# Altium schematic sheet Microcontroller (F446).SchDoc
size A3; SheetNumber: 4; SheetTotal: 6
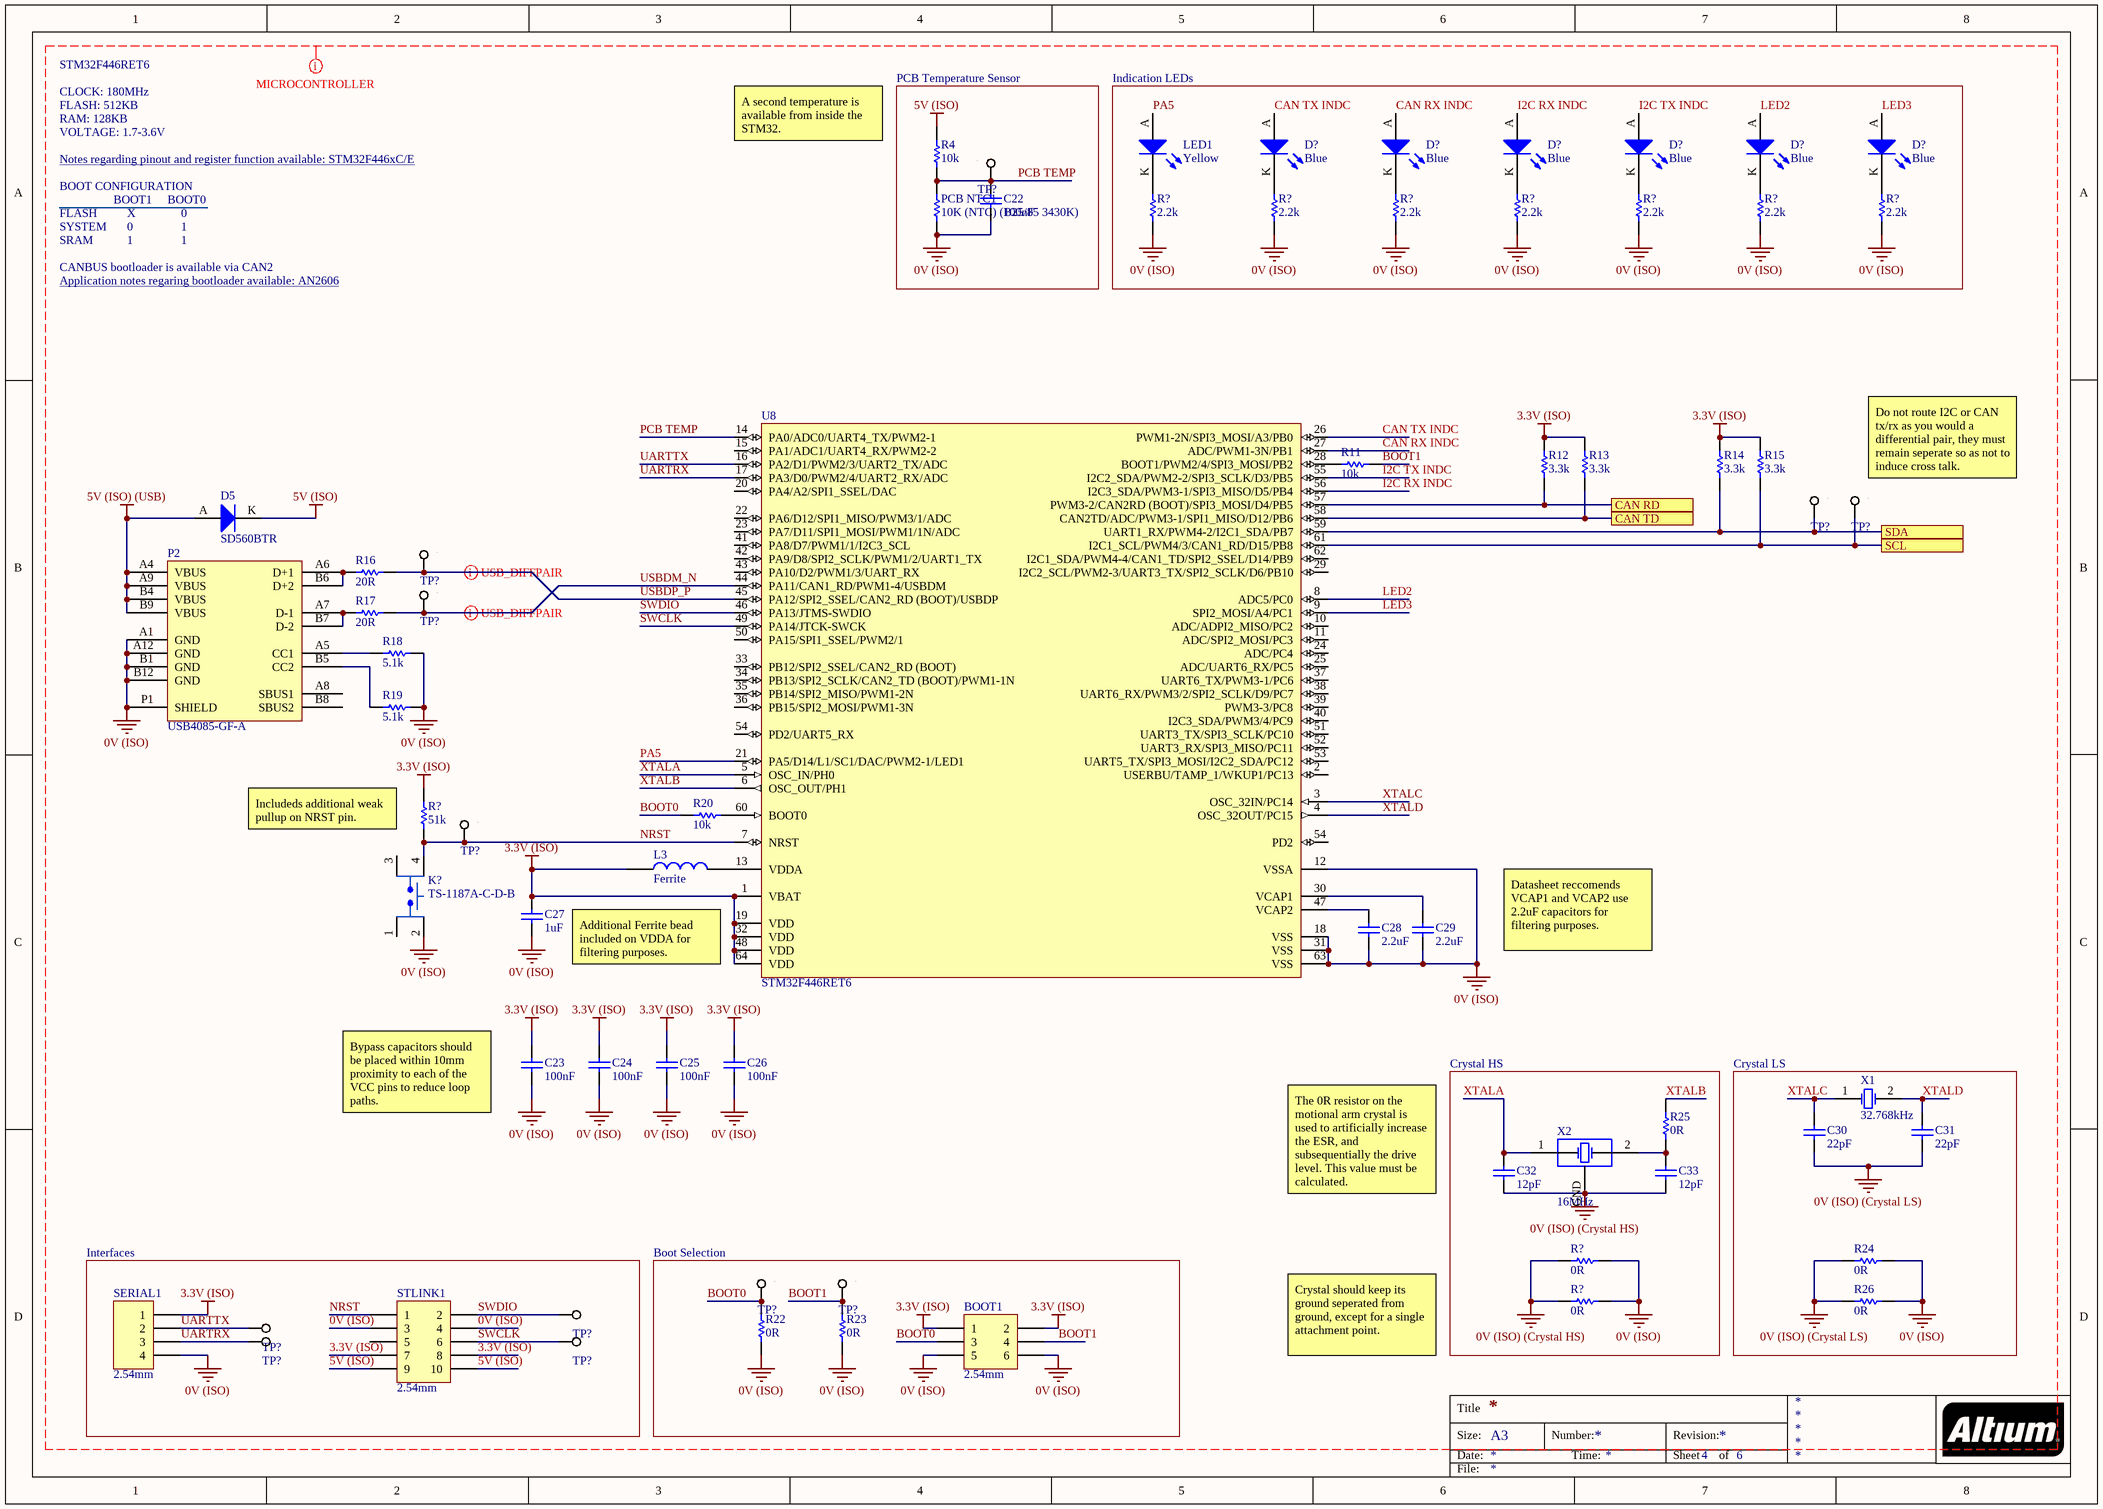
[diagram p0: Microcontroller (F446).SchDoc]

## Parts
(Parts that share a designator on the sheet are numbered #1, #2 ... from top to bottom, then left to right.)
BOOT1  2.54mm  [TH 2.54mm Header 2x3]
C22  100nF  [0805]
C23  100nF  [0805]
C24  100nF  [0805]
C25  100nF  [0805]
C26  100nF  [0805]
C27  1uF  [0805]
C28  2.2uF  [0805]
C29  2.2uF  [0805]
C30  22pF  [0805]
C31  22pF  [0805]
C32  12pF  [0805]
C33  12pF  [0805]
D5  SD560BTR  [SMB Diode]
D?#1  Blue  [0805 LED]
D?#2  Blue  [0805 LED]
D?#3  Blue  [0805 LED]
D?#4  Blue  [0805 LED]
D?#5  Blue  [0805 LED]
D?#6  Blue  [0805 LED]
K?  TS-1187A-C-D-B  [XKB SW-4.5]
L3  Ferrite  [0805]
LED1  Yellow  [0805 LED]
P2  USB4085-GF-A  [USB4085-GF-A]
PCB_NTC1  10K (NTC) (B25/85 3430K)  [0805]
R4  10k  [0805]
R11  10k  [0805]
R12  3.3k  [0805]
R13  3.3k  [0805]
R14  3.3k  [0805]
R15  3.3k  [0805]
R16  20R  [0805]
R17  20R  [0805]
R18  5.1k  [0805]
R19  5.1k  [0805]
R20  10k  [0805]
R22  0R  [0805]
R23  0R  [0805]
R24  0R  [0805]
R25  0R  [0805]
R26  0R  [0805]
R?#1  2.2k  [0805]
R?#2  2.2k  [0805]
R?#3  2.2k  [0805]
R?#4  2.2k  [0805]
R?#5  2.2k  [0805]
R?#6  2.2k  [0805]
R?#7  2.2k  [0805]
R?#8  51k  [0805]
R?#9  0R  [0805]
R?#10  0R  [0805]
SERIAL1  2.54mm  [TH 2.54mm Header 1x4]
STLINK1  2.54mm  [TH 2.54mm Header 2x5]
TP?#1  0mm  [SMD Test Point 1mm]  (value not drawn)
TP?#2  0mm  [SMD Test Point 1mm]  (value not drawn)
TP?#3  0mm  [SMD Test Point 1mm]  (value not drawn)
TP?#4  0mm  [SMD Test Point 1mm]  (value not drawn)
TP?#5  0mm  [SMD Test Point 1mm]  (value not drawn)
TP?#6  0mm  [SMD Test Point 1mm]  (value not drawn)
TP?#7  0mm  [SMD Test Point 1mm]  (value not drawn)
TP?#8  0mm  [SMD Test Point 1mm]  (value not drawn)
TP?#9  0mm  [SMD Test Point 1mm]  (value not drawn)
TP?#10  0mm  [SMD Test Point 1mm]  (value not drawn)
TP?#11  0mm  [SMD Test Point 1mm]  (value not drawn)
TP?#12  0mm  [SMD Test Point 1mm]  (value not drawn)
U8  STM32F446RET6  [STM 64-LQFP]
X1  32.768kHz  [EPSON 2-SMD]
X2  16MHz  [Abracon 4-SMD 3.2x2.5]

## Blocks framed on the sheet
PCB Temperature Sensor: C22 PCB_NTC1 R4 TP?#1
Indication LEDs: D?#1-D?#6 LED1 R?#1-R?#7
Crystal HS: C32 C33 R25 R?#9 R?#10 X2
Crystal LS: C30 C31 R24 R26 X1
Interfaces: SERIAL1 STLINK1 TP?#9-TP?#12
Boot Selection: BOOT1 R22 R23 TP?#7 TP?#8

## Ports
CAN RD, CAN TD, SCL, SDA

## Nets
0V (ISO): BOOT1.5 BOOT1.6 C22.1 C23.1 C24.1 C25.1 C26.1 C27.1 C28.1 C29.1 K?.2(VDD) P2.A1(GND) P2.A12(GND) P2.B1(GND) P2.B12(GND) P2.P1(SHIELD) PCB_NTC1.1 R18.2 R19.2 R22.1 R23.1 R24.1 R26.1 R?#1.1 R?#2.1 R?#3.1 R?#4.1 R?#5.1 R?#6.1 R?#7.1 R?#9.1 R?#10.1 SERIAL1.4 STLINK1.3 STLINK1.4 U8.12(VSSA) U8.18(VSS) U8.31(VSS) U8.63(VSS)
0V (ISO) (Crystal HS): C32.1 C33.1 R?#9.2 R?#10.2 X2.GND
0V (ISO) (Crystal LS): C30.1 C31.1 R24.2 R26.2
3.3V (ISO): BOOT1.1 BOOT1.2 C23.2 C24.2 C25.2 C26.2 C27.2 L3.2 R12.2 R13.2 R14.2 R15.2 R?#8.2 SERIAL1.1 STLINK1.7 STLINK1.8 U8.1(VBAT) U8.19(VDD) U8.32(VDD) U8.48(VDD) U8.64(VDD)
5V (ISO): D5.K R4.2 STLINK1.9 STLINK1.10
5V (ISO) (USB): D5.A P2.A4(VBUS) P2.A9(VBUS) P2.B4(VBUS) P2.B9(VBUS)
BOOT0: BOOT1.3 R20.1 R22.2 TP?#7.1
BOOT1: BOOT1.4 R11.2 R23.2 TP?#8.1
CAN RD: R12.1 U8.57(PWM3-2/CAN2RD_(BOOT)/SPI3_MOSI/D4/PB5) ; port CAN RD
CAN RX INDC: D?#2.A U8.27(ADC/PWM1-3N/PB1)
CAN TD: R13.1 U8.58(CAN2TD/ADC/PWM3-1/SPI1_MISO/D12/PB6) ; port CAN TD
CAN TX INDC: D?#1.A U8.26(PWM1-2N/SPI3_MOSI/A3/PB0)
I2C RX INDC: D?#3.A U8.56(I2C3_SDA/PWM3-1/SPI3_MISO/D5/PB4)
I2C TX INDC: D?#4.A U8.55(I2C2_SDA/PWM2-2/SPI3_SCLK/D3/PB5)
LED2: D?#5.A U8.8(ADC5/PC0)
LED3: D?#6.A U8.9(SPI2_MOSI/A4/PC1)
NRST: K?.4(VDD) R?#8.1 STLINK1.1 TP?#6.1 U8.7(NRST)
PA5: LED1.A U8.21(PA5/D14/L1/SC1/DAC/PWM2-1/LED1)
PCB TEMP: C22.2 PCB_NTC1.2 R4.1 TP?#1.1 U8.14(PA0/ADC0/UART4_TX/PWM2-1)
SCL: R15.1 TP?#3.1 U8.61(I2C1_SCL/PWM4/3/CAN1_RD/D15/PB8) ; port SCL
SDA: R14.1 TP?#2.1 U8.59(UART1_RX/PWM4-2/I2C1_SDA/PB7) ; port SDA
SWCLK: STLINK1.6 TP?#12.1 U8.49(PA14/JTCK-SWCK)
SWDIO: STLINK1.2 TP?#9.1 U8.46(PA13/JTMS-SWDIO)
UARTRX: SERIAL1.3 TP?#11.1 U8.17(PA3/D0/PWM2/4/UART2_RX/ADC)
UARTTX: SERIAL1.2 TP?#10.1 U8.16(PA2/D1/PWM2/3/UART2_TX/ADC)
USBDM_N: R17.2 TP?#5.1 U8.44(PA11/CAN1_RD/PWM1-4/USBDM)
USBDP_P: R16.2 TP?#4.1 U8.45(PA12/SPI2_SSEL/CAN2_RD_(BOOT)/USBDP)
XTALA: C32.2 U8.5(OSC_IN/PH0) X2.1(OSC1)
XTALB: R25.2 U8.6(OSC_OUT/PH1)
XTALC: C30.2 U8.3(OSC_32IN/PC14) X1.1(OSC1)
XTALD: C31.2 U8.4(OSC_32OUT/PC15) X1.2(OSC2)
NetC28_2: C28.2 U8.47(VCAP2)
NetC29_2: C29.2 U8.30(VCAP1)
NetC33_2: C33.2 R25.1 X2.2(OSC2)
NetD?#1_K: D?#1.K R?#2.2
NetD?#2_K: D?#2.K R?#3.2
NetD?#3_K: D?#3.K R?#4.2
NetD?#4_K: D?#4.K R?#5.2
NetD?#5_K: D?#5.K R?#6.2
NetD?#6_K: D?#6.K R?#7.2
NetL3_1: L3.1 U8.13(VDDA)
NetLED1_K: LED1.K R?#1.2
NetP2_A5: P2.A5(CC1) R18.1
NetP2_A6: P2.A6(D+1) P2.B6(D+2) R16.1
NetP2_A7: P2.A7(D-1) P2.B7(D-2) R17.1
NetP2_B5: P2.B5(CC2) R19.1
NetR11_1: R11.1 U8.28(BOOT1/PWM2/4/SPI3_MOSI/PB2)
NetR20_2: R20.2 U8.60(BOOT0)

Not connected (* = marked no-connect by the designer): K? 1(VDD) 3(VDD); P2 A8(SBUS1) B8(SBUS2); STLINK1 5; U8 2(USERBU/TAMP_1/WKUP1/PC13) 10(ADC/ADPI2_MISO/PC2) 11(ADC/SPI2_MOSI/PC3) 15(PA1/ADC1/UART4_RX/PWM2-2) 20(PA4/A2/SPI1_SSEL/DAC) 22(PA6/D12/SPI1_MISO/PWM3/1/ADC) 23(PA7/D11/SPI1_MOSI/PWM1/1N/ADC) 24(ADC/PC4) 25(ADC/UART6_RX/PC5) 29(I2C2_SCL/PWM2-3/UART3_TX/SPI2_SCLK/D6/PB10) 33(PB12/SPI2_SSEL/CAN2_RD_(BOOT)) 34(PB13/SPI2_SCLK/CAN2_TD_(BOOT)/PWM1-1N) 35(PB14/SPI2_MISO/PWM1-2N) 36(PB15/SPI2_MOSI/PWM1-3N) 37(UART6_TX/PWM3-1/PC6) 38(UART6_RX/PWM3/2/SPI2_SCLK/D9/PC7) 39(PWM3-3/PC8) 40(I2C3_SDA/PWM3/4/PC9) 41(PA8/D7/PWM1/1/I2C3_SCL) 42(PA9/D8/SPI2_SCLK/PWM1/2/UART1_TX) 43(PA10/D2/PWM1/3/UART_RX) 50(PA15/SPI1_SSEL/PWM2/1) 51(UART3_TX/SPI3_SCLK/PC10) 52(UART3_RX/SPI3_MISO/PC11) 53(UART5_TX/SPI3_MOSI/I2C2_SDA/PC12) 54(PD2) 62(I2C1_SDA/PWM4-4/CAN1_TD/SPI2_SSEL/D14/PB9)

## Layout directives
differential pair; differential pair class USB_DIFFPAIR: USBDM_N, USBDP_P
net class MICROCONTROLLER: 0V (ISO), 0V (ISO) (Crystal HS), 0V (ISO) (Crystal LS), 3.3V (ISO), 5V (ISO), 5V (ISO) (USB), BOOT0, BOOT1, CAN RX INDC, CAN TX INDC, I2C RX INDC, I2C TX INDC, LED2, LED3, NRST, PA5, PCB TEMP, SWCLK, SWDIO, UARTRX, UARTTX, USBDM_N, USBDP_P, XTALA, XTALB, XTALC, XTALD

## Notes on the sheet
- STM32F446RET6
- CLOCK: 180MHz
- FLASH: 512KB
- Notes regarding pinout and register function available: STM32F446xC/E <https://www.st.com/content/ccc/resource/technical/document/datasheet/65/cb/75/50/53/d6/48/24/DM00141306.pdf/files/DM00141306.pdf/jcr:content/translations/en.DM00141306.pdf>
- RAM: 128KB
- VOLTAGE: 1.7-3.6V
- A second temperature is available from inside the STM32.
- BOOT CONFIGURATION
- FLASH
- SYSTEM
- SRAM
- BOOT1
- X
- 1
- 0
- BOOT0
- CANBUS bootloader is available via CAN2
- Application notes regaring bootloader available: AN2606 <https://www.st.com/resource/en/application_note/cd00167594-stm32-microcontroller-system-memory-boot-mode-stmicroelectronics.pdf>
- (near TP?#3) Do not route I2C or CAN tx/rx as you would a differential pair, they must remain seperate so as not to induce cross talk.
- (near R?#8) Includeds additional weak pullup on NRST pin.
- Additional Ferrite bead included on VDDA for filtering purposes.
- Datasheet reccomends VCAP1 and VCAP2 use 2.2uF capacitors for filtering purposes.
- (near C23) Bypass capacitors should be placed within 10mm proximity to each of the VCC pins to reduce loop paths.
- The 0R resistor on the motional arm crystal is used to artificially increase the ESR, and subsequentially the drive level. This value must be calculated.
- Crystal should keep its ground seperated from ground, except for a single attachment point.
- Title
- Size:
- Date:
- A3
- Number:
- Time:
- Revision:
- Sheet
- of
- File:

## Library data of the parts
BOOT1 = TH 2.54mm Header 2x3: Positions: 6; Angle: 0; Flange: No; Contact: NA; Part Number: TH 2.54mm Header 2x3; Pitch: 2.54mm; Row Spacing: 2.54mm
C22 = GCM21BR71E104KA37L: Manufacturer: muRata; Tolerance: 10%; Material: X7R; Rated Voltage: 25V; Part Number: GCM21BR71E104KA37L; Value: 100nF; Digikey Part Number: DO NOT USE FOR NEW DESIGNS
C23-C26 = GCM21BR71H104KA37L: Manufacturer: muRata; Tolerance: ±10%; Material: X7R; Rated Voltage: 50V; Part Number: GCM21BR71H104KA37L; Value: 100nF; Digikey Part Number: 490-6064-1-ND
C27 = AC0805KKX7R8BB105: Manufacturer: YAGEO; Tolerance: 10%; Material: X7R; Rated Voltage: 25V; Part Number: AC0805KKX7R8BB105; Value: 1uF; Digikey Part Number: DO NOT USE FOR NEW DESIGNS
C28 C29 = GCM21BR61C225KA37L: Manufacturer: muRata; Tolerance: 10%; Material: X5R; Rated Voltage: 16V; Part Number: GCM21BR61C225KA37L; Value: 2.2uF; Digikey Part Number: DO NOT USE FOR NEW DESIGNS
C30 C31 = GRM21A5C2E220JW01D: Manufacturer: muRata; Tolerance: ±5%; Material: C0G, NP0; Rated Voltage: 250V; Part Number: GRM21A5C2E220JW01D; Value: 22pF; Digikey Part Number: 490-5534-1-ND
C32 C33 = GCM21B5c1H120JA37L: Manufacturer: muRata; Tolerance: 5%; Material: C0G; Rated Voltage: 50V; Part Number: GCM21B5c1H120JA37L; Value: 12pF; Digikey Part Number: DO NOT USE FOR NEW DESIGNS
D5 = SD560BTR: 1.2V_F 600V 5A SMB; Manufacturer: SMC Diode Solutions; Part Number: SD560BTR; Digikey Part Number: 1655-1530-2-ND; Digikey Link: https://www.digikey.com/product-detail/en/smc-diode-solutions/SD560BTR/1655-1530-2-ND/6022620
D?#1-D?#6 = SML-MN2BCTT86C: LED BLUE CLEAR 2012 SMD; Manufacturer: ROHM Semiconductor; Part Number: SML-MN2BCTT86C; Colour: Blue; Digikey Part Number: 846-1207-1-ND; Digikey Link: https://www.digikey.com/product-detail/en/rohm-semiconductor/SMLMN2BCTT86C/846-1207-1-ND/6057239
K? = TS-1187A-C-D-B: TACTILE SWITCHES SPST 5.10MM X 5.10MM 0.80MM SMD ROHS; Manufacturer: XKB Enerprise; Part Number: TS-1187A-C-D-B; Link: https://jlcpcb.com/client/index.html#/parts/componentSearch?searchTxt=usb
L3 = MMZ2012Y202BTD25: Manufacturer: TDK Corportation; Impedence: 2 kOhms @ 100MHz; Material: Ferrite Bead; Rated Current: 400mA; Part Number: MMZ2012Y202BTD25; Value: Ferrite; Digikey Part Number: 445-172872-1-ND
LED1 = SML-211YTT86: Yellow LED Indication - Discrete 1.75V 0805 (2012 Metric); Manufacturer: ROHM Semiconductor; Part Number: SML-211YTT86; Colour: Yellow; Digikey Part Number: 511-1293-1-ND; Digikey Link: https://www.digikey.com/product-detail/en/rohm-semiconductor/SML-211YTT86/511-1293-1-ND/637106
P2 = USB4085-GF-A: USB - C (Type - C) USB 2.0 Receptacle Connector 16 Position Through Hole, Right Angle; Angle: 90; Part Number: USB4085-GF-A; Digikey Part Number: 2073-USB4085-GF-ACT-ND; Digikey Link: https://www.digikey.ee/product-detail/en/gct/USB4085-GF-A/2073-USB4085-GF-ACT-ND/9859733
PCB_NTC1 = NTCS0805E3103FLT: Manufacturer: Vishay Beyschlag; Tolerance: 0.01; Rated Voltage: 210mW; Part Number: NTCS0805E3103FLT; Value: 10K (NTC) (B25/85 3430K); Digikey Part Number: BC2733CT-ND
R4 R11 R20 = RC0805FR0710KL: Manufacturer: YAGEO; Tolerance: 0.01; Rated Voltage: 0.125W; Part Number: RC0805FR0710KL; Value: 10k; Material: FR-07; Digikey Part Number: 311-10.0KCRCT-ND
R12-R15 = RC0805FR073K3L: Manufacturer: YAGEO; Tolerance: 0.01; Rated Voltage: 0.125W; Part Number: RC0805FR073K3L; Value: 3.3k; Material: FR-07; Digikey Part Number: 311-3.30KCRCT-ND
R16 R17 = RC0805FR0720RL: Manufacturer: YAGEO; Tolerance: 0.01; Rated Voltage: 0.125W; Part Number: RC0805FR0720RL; Value: 20R; Material: FR-07; Digikey Part Number: 311-20.0CRCT-ND
R18 R19 = RC0805FR075K1L: Manufacturer: YAGEO; Tolerance: 0.01; Rated Voltage: 0.125W; Part Number: RC0805FR075K1L; Value: 5.1k; Material: FR-07; Digikey Part Number: 311-5.10KCRCT-ND
R22-R26 R?#9 R?#10 = RC0805FR070RL: Manufacturer: YAGEO; Tolerance: 0.01; Rated Voltage: 0.125W; Part Number: RC0805FR070RL; Value: 0R; Material: FR-07; Digikey Part Number: 311-0.0CRCT-ND
R?#1-R?#7 = RC0805FR072K2L: Manufacturer: YAGEO; Tolerance: 0.01; Rated Voltage: 0.125W; Part Number: RC0805FR072K2L; Value: 2.2k; Material: FR-07; Digikey Part Number: 311-2.20KCRCT-ND
R?#8 = RC0805FR0751KL: Manufacturer: YAGEO; Tolerance: 0.01; Rated Voltage: 0.125W; Part Number: RC0805FR0751KL; Value: 51k; Material: FR-07; Digikey Part Number: 311-51.0KCRCT-ND
SERIAL1 = TH 2.54mm Header 1x4: Positions: 4; Angle: 0; Flange: No; Contact: NA; Part Number: TH 2.54mm Header 1x4; Pitch: 2.54mm; Row Spacing: 2.54mm
STLINK1 = TH 2.54mm Header 2x5: Positions: 10; Angle: 0; Flange: No; Contact: NA; Part Number: TH 2.54mm Header 2x5; Pitch: 2.54mm; Row Spacing: 2.54mm
TP?#1-TP?#12 = SMD Test Point Small: Positions: 1; Row Spacing: 0; Flange: No; Contact: NA; Part Number: SMD Test Point Small; Pitch: 0mm; Angle: 0
U8 = STM32F446RET6: ARM® Cortex®-M4 STM32F4 Microcontroller IC 32-Bit 180MHz 512KB (512K x 8) FLASH 64-LQFP (10x10); Manufacturer: STMicroelectronics; Part Number: STM32F446RET6; Digikey Part Number: 497-15376-ND; Digikey Link: https://www.digikey.com.au/product-detail/en/stmicroelectronics/STM32F446RET6/497-15376-ND/5175962
X1 = FC-135 32.7680KA-A5: Manufacturer: EPSON; Load Capacitance: 12.5pF; ESR: 70k; Part Number: FC-135 32.7680KA-A5; Value: 32.768kHz; Digikey Part Number: SER4103TR-ND; Digikey Link: https://www.digikey.com/product-detail/en/epson/FC-135-32.7680KA-A5/SER4103TR-ND/5259895
X2 = ABM8AIG-16.000MHZ-12-2Z-T3: Manufacturer: Abracon LLC; Load Capacitance: 12pF; ESR: 70R; Part Number: ABM8AIG-16.000MHZ-12-2Z-T3; Value: 16MHz; Digikey Part Number: 535-13386-1-ND; Digikey Link: https://www.digikey.com/en/products/detail/abracon-llc/ABM8AIG-16-000MHZ-12-2Z-T3/5817586